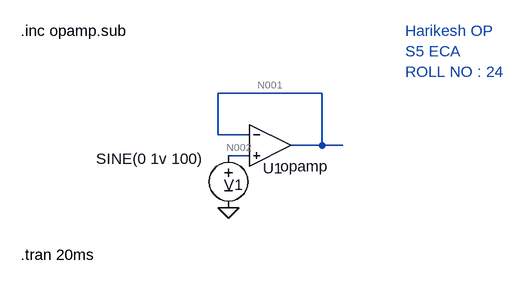
[diagram p0: schematic VOLTAGE_FOLLOWER.asc]
VOLTAGE_FOLLOWER.asc, the LTspice schematic file:
Version 4
SHEET 1 880 680
WIRE 272 48 112 48
WIRE 112 112 112 48
WIRE 160 112 112 112
WIRE 272 128 272 48
WIRE 272 128 224 128
WIRE 304 128 272 128
WIRE 160 144 128 144
FLAG 128 224 0
SYMBOL OpAmps\\opamp 192 64 R0
WINDOW 0 -11 99 Left 2
SYMATTR InstName U1
SYMBOL voltage 128 128 R0
WINDOW 123 0 0 Left 0
WINDOW 39 0 0 Left 0
WINDOW 0 -7 61 Left 2
WINDOW 3 -204 21 Left 2
SYMATTR InstName V1
SYMATTR Value SINE(0 1v 100)
TEXT -192 -48 Left 2 !.inc opamp.sub
TEXT 400 -48 Left 2 ;Harikesh OP\nS5 ECA \nROLL NO : 24
TEXT -192 296 Left 2 !.tran 20ms

The netlist it stands for:
* VOLTAGE_FOLLOWER.asc
XU1 N001 N002 N001 opamp Aol=100K GBW=10Meg  ; pins invin noninvin out
V1 N002 0 SINE(0 1v 100)
.inc opamp.sub
* Harikesh OP
* S5 ECA
* ROLL NO : 24
.tran 20ms
.backanno
.end

* Results of the author's LTspice run, read from the files saved beside the schematic
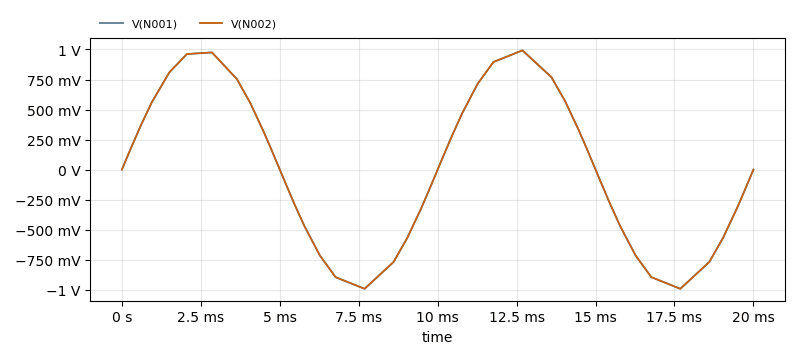
[diagram p1: Transient Analysis of VOLTAGE_FOLLOWER.asc, plotted from the saved traces]
* Transient Analysis, 1 run:
*   V(N001): min -992.6 mV, max 992.6 mV, average 713.4 µV, rms 697.5 mV, last -10 µV
*   V(N002): min -992.6 mV, max 992.6 mV, average 713.5 µV, rms 697.5 mV, last 0 V